# Altium schematic sheet 08 DDR VTT_LEDs.SchDoc
size 420 x 297 mm
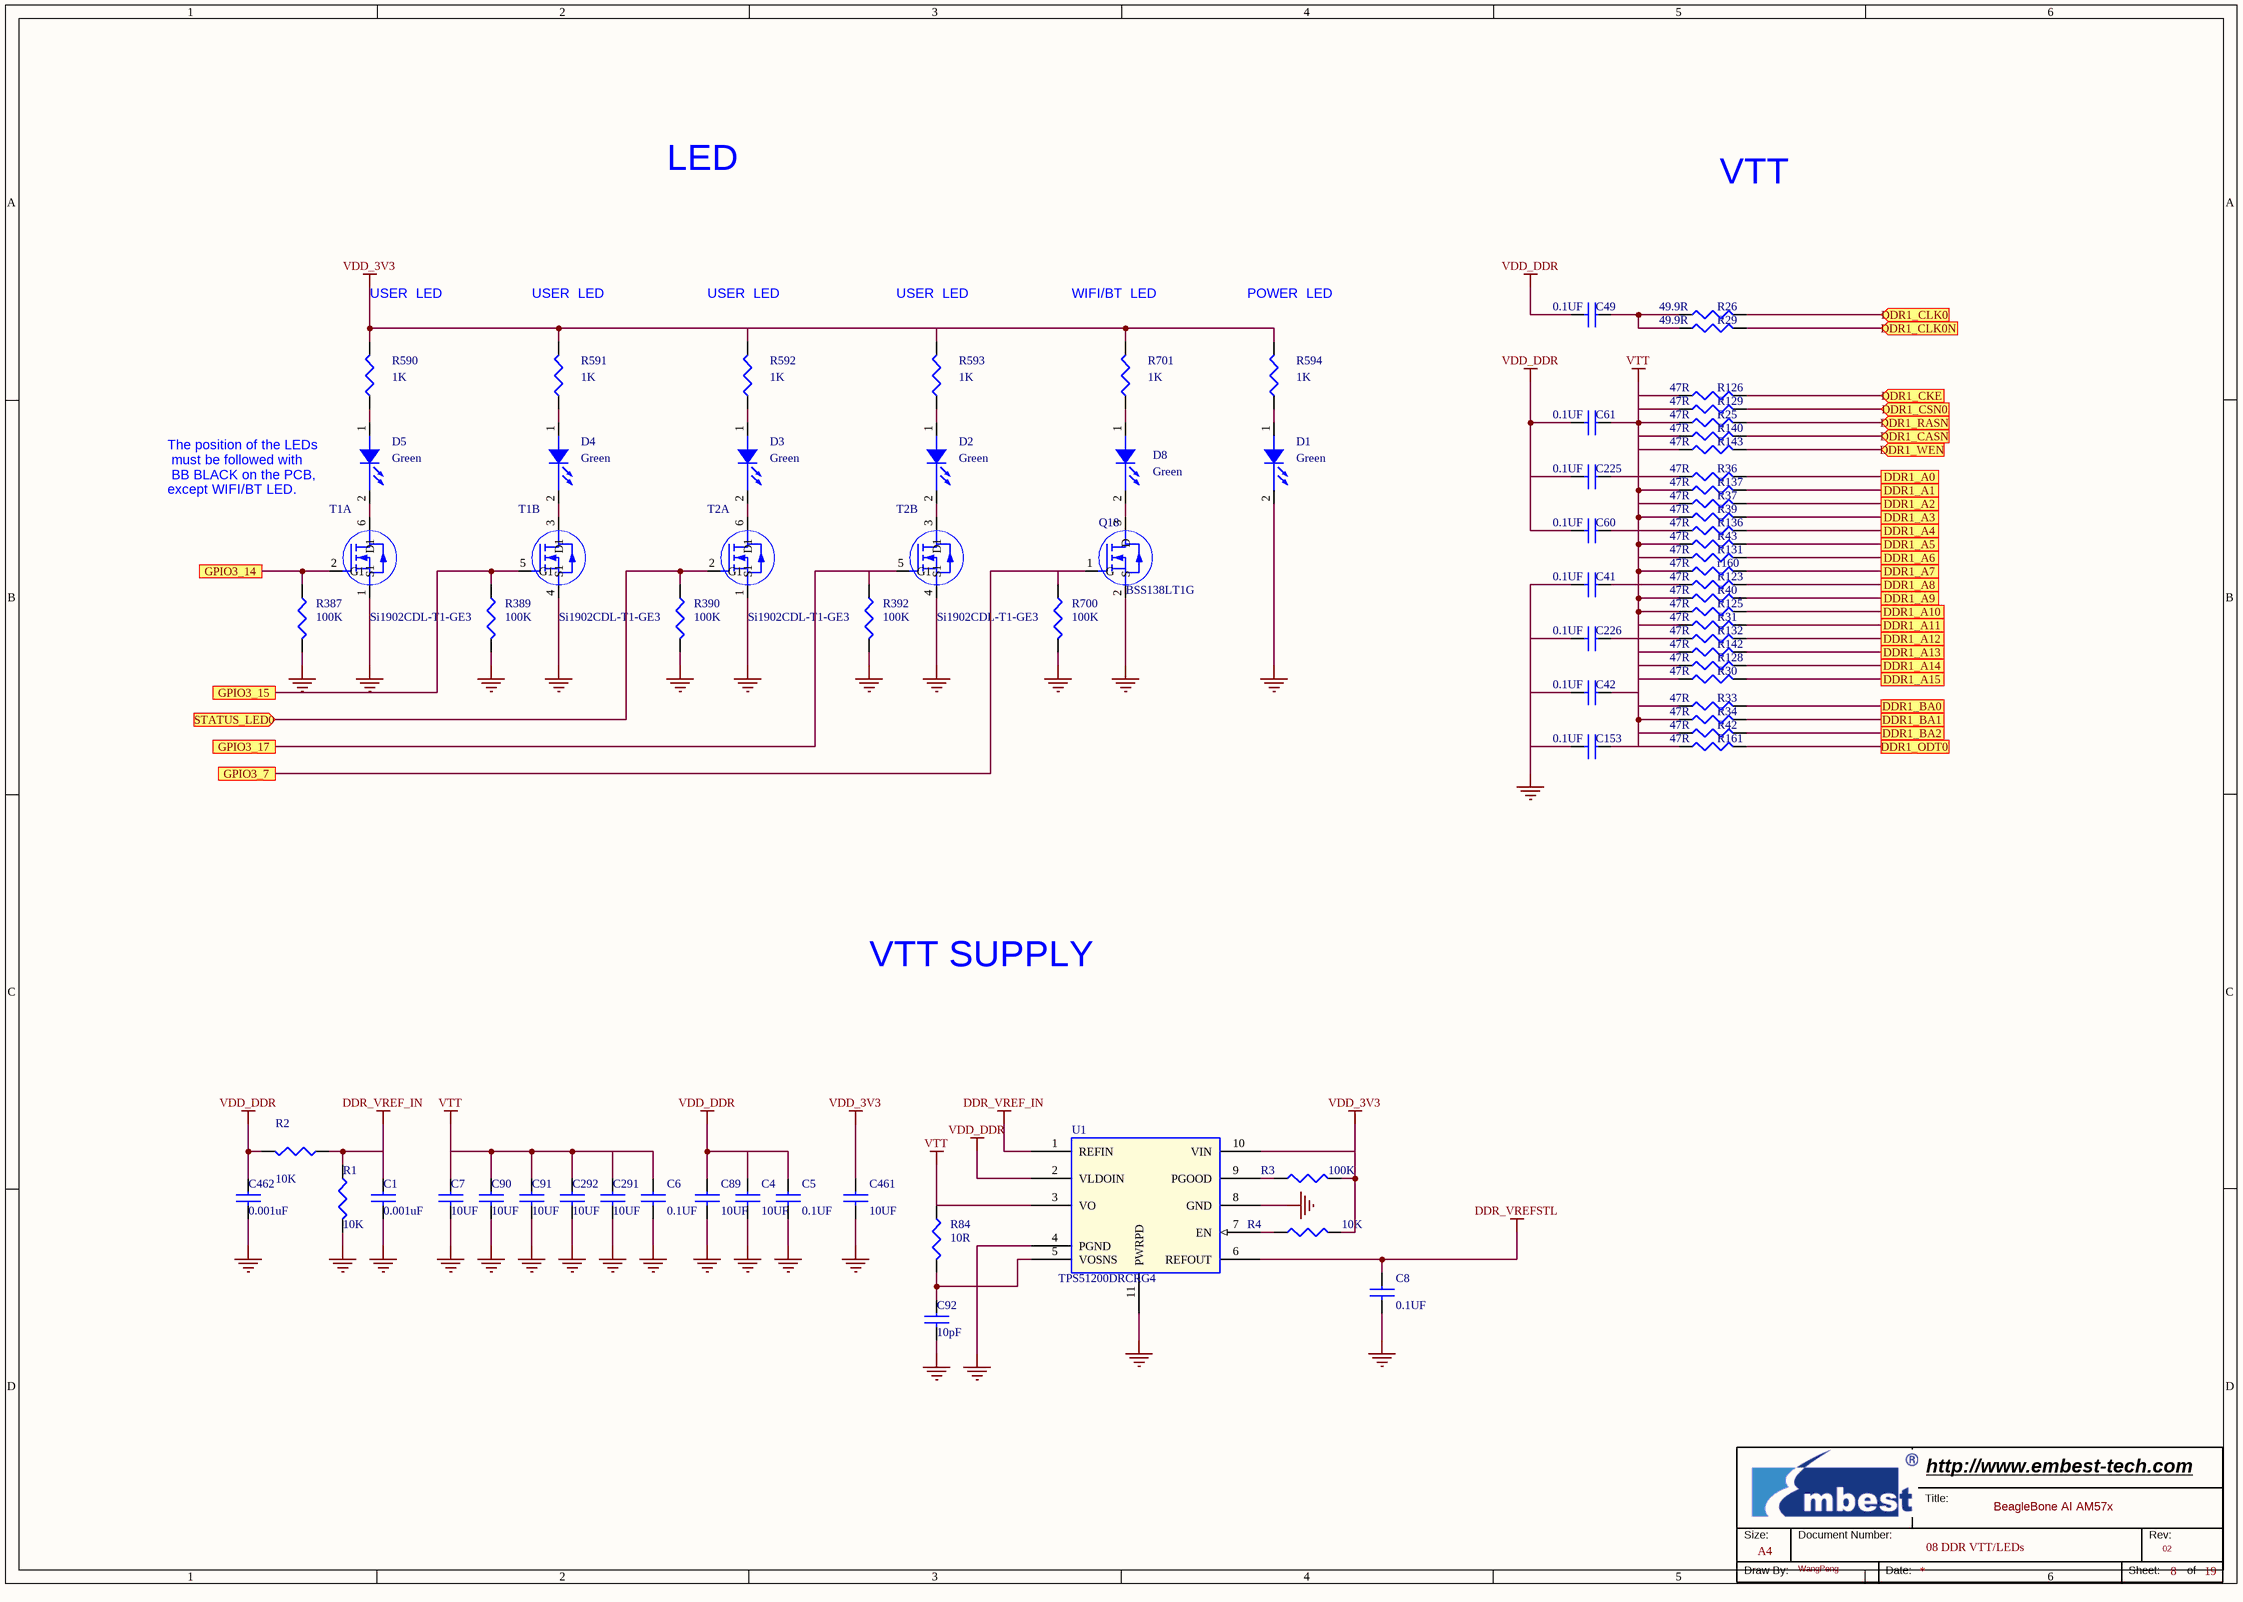
[diagram p0: 08 DDR VTT_LEDs.SchDoc]

## Parts
*  Page Count: 19  Page Number: 8  Page Size: A4  Title: BeagleBone AI AM57x  RevCode: 02  Doc: 08 DDR VTT/LEDs  Drawing: WangPeng  (hidden comment: Embest Title)  (graphical)
C1  0.001uF  [C0402]
C4  10UF  [C0603]
C5  0.1UF  [C0402]
C6  0.1UF  [C0402]
C7  10UF  [C0603]
C8  0.1UF  [C0402]
C41  0.1UF  [C0402]
C42  0.1UF  [C0402]
C49  0.1UF  [C0402]
C60  0.1UF  [C0402]
C61  0.1UF  [C0402]
C89  10UF  [C0603]
C90  10UF  [C0603]
C91  10UF  [C0603]
C92  10pF  [C0402]
C153  0.1UF  [C0402]
C225  0.1UF  [C0402]
C226  0.1UF  [C0402]
C291  10UF  [C0603]
C292  10UF  [C0603]
C461  10UF  [C0603]
C462  0.001uF  [C0402]
D1  Green  [D0603]
D2  Green  [D0603]
D3  Green  [D0603]
D4  Green  [D0603]
D5  Green  [D0603]
D8  Green  [D0603]
Q18  BSS138LT1G  [SOT95P240X111-3N]
R1  10K  [R0402]
R2  10K  [R0402]
R3  100K  [R0402]
R4  10K  [R0402]
R25  47R  [R0402]
R26  49.9R  [R0402]
R29  49.9R  [R0402]
R30  47R  [R0402]
R31  47R  [R0402]
R33  47R  [R0402]
R34  47R  [R0402]
R36  47R  [R0402]
R37  47R  [R0402]
R39  47R  [R0402]
R40  47R  [R0402]
R42  47R  [R0402]
R43  47R  [R0402]
R84  10R  [R0402]
R123  47R  [R0402]
R125  47R  [R0402]
R126  47R  [R0402]
R128  47R  [R0402]
R129  47R  [R0402]
R131  47R  [R0402]
R132  47R  [R0402]
R136  47R  [R0402]
R137  47R  [R0402]
R140  47R  [R0402]
R142  47R  [R0402]
R143  47R  [R0402]
r160  47R  [R0402]
R161  47R  [R0402]
R387  100K  [R0402]
R389  100K  [R0402]
R390  100K  [R0402]
R392  100K  [R0402]
R590  1K  [R0402]
R591  1K  [R0402]
R592  1K  [R0402]
R593  1K  [R0402]
R594  1K  [R0402]
R700  100K  [R0402]
R701  1K  [R0402]
T1  Si1902CDL-T1-GE3  [sot363_6]  (parts A,B of 2)
T2  Si1902CDL-T1-GE3  [sot363_6]  (parts A,B of 2)
U1  TPS51200DRCRG4  [VSON50P300X300X100-11N]

## Ports
DDR1_A0, DDR1_A1, DDR1_A2, DDR1_A3, DDR1_A4, DDR1_A5, DDR1_A6, DDR1_A7, DDR1_A8, DDR1_A9, DDR1_A10, DDR1_A11, DDR1_A12, DDR1_A13, DDR1_A14, DDR1_A15, DDR1_BA0, DDR1_BA1, DDR1_BA2, DDR1_CASN (in), DDR1_CKE (in), DDR1_CLK0 (in), DDR1_CLK0N (in), DDR1_CSN0 (in), DDR1_ODT0, DDR1_RASN (in), DDR1_WEN (in), GPIO3_7, GPIO3_14, GPIO3_15, GPIO3_17, STATUS_LED0 (in)

## Nets
DDR_VREF_IN: C1.1 R1.1 R2.1 U1.1(REFIN)
DDR_VREFSTL: C8.1 U1.6(REFOUT)
GND: C1.2 C4.2 C5.2 C6.2 C7.2 C8.2 C41.2 C42.2 C89.2 C90.2 C91.2 C92.2 C153.2 C226.2 C291.2 C292.2 C461.2 C462.2 D1.2(C) Q18.2(S) R1.2 R387.2 R389.2 R390.2 R392.2 R700.2 T1.1(S1) T1.4(S1) T2.1(S1) T2.4(S1) U1.4(PGND) U1.8(GND) U1.11(PWRPD)
VDD_3V3: C461.1 R3.2 R4.2 R590.2 R591.2 R592.2 R593.2 R594.2 R701.2 U1.10(VIN)
VDD_DDR: C4.1 C5.1 C49.2 C60.2 C61.2 C89.1 C225.2 C462.1 R2.2 U1.2(VLDOIN)
VTT: C6.1 C7.1 C42.1 C61.1 C90.1 C91.1 C153.1 C226.1 C291.1 C292.1 R25.2 R30.2 R31.2 R33.2 R34.2 R37.2 R39.2 R40.2 R42.2 R43.2 R84.1 R125.2 R126.2 R128.2 R129.2 R131.2 R132.2 R137.2 R140.2 R142.2 R143.2 r160.2 R161.2 U1.3(VO)
DDR1_A0: R36.1 ; port DDR1_A0
DDR1_A1: R137.1 ; port DDR1_A1
DDR1_A2: R37.1 ; port DDR1_A2
DDR1_A3: R39.1 ; port DDR1_A3
DDR1_A4: R136.1 ; port DDR1_A4
DDR1_A5: R43.1 ; port DDR1_A5
DDR1_A6: R131.1 ; port DDR1_A6
DDR1_A7: r160.1 ; port DDR1_A7
DDR1_A8: R123.1 ; port DDR1_A8
DDR1_A9: R40.1 ; port DDR1_A9
DDR1_A10: R125.1 ; port DDR1_A10
DDR1_A11: R31.1 ; port DDR1_A11
DDR1_A12: R132.1 ; port DDR1_A12
DDR1_A13: R142.1 ; port DDR1_A13
DDR1_A14: R128.1 ; port DDR1_A14
DDR1_A15: R30.1 ; port DDR1_A15
DDR1_BA0: R33.1 ; port DDR1_BA0
DDR1_BA1: R34.1 ; port DDR1_BA1
DDR1_BA2: R42.1 ; port DDR1_BA2
DDR1_CASN: R140.1 ; port DDR1_CASN
DDR1_CKE: R126.1 ; port DDR1_CKE
DDR1_CLK0: R26.1 ; port DDR1_CLK0
DDR1_CLK0N: R29.1 ; port DDR1_CLK0N
DDR1_CSN0: R129.1 ; port DDR1_CSN0
DDR1_ODT0: R161.1 ; port DDR1_ODT0
DDR1_RASN: R25.1 ; port DDR1_RASN
DDR1_WEN: R143.1 ; port DDR1_WEN
GPIO3_7: Q18.1(G) R700.1 ; port GPIO3_7
GPIO3_14: R387.1 T1.2(G1) ; port GPIO3_14
GPIO3_15: R389.1 T1.5(G1) ; port GPIO3_15
GPIO3_17: R392.1 T2.5(G1) ; port GPIO3_17
STATUS_LED0: R390.1 T2.2(G1) ; port STATUS_LED0
NetC41_1: C41.1 R123.2
NetC49_1: C49.1 R26.2 R29.2
NetC60_1: C60.1 R136.2
NetC92_1: C92.1 R84.2 U1.5(VOSNS)
NetC225_1: C225.1 R36.2
NetD1_1: D1.1(A) R594.1
NetD2_1: D2.1(A) R593.1
NetD2_2: D2.2(C) T2.3(D1)
NetD3_1: D3.1(A) R592.1
NetD3_2: D3.2(C) T2.6(D1)
NetD4_1: D4.1(A) R591.1
NetD4_2: D4.2(C) T1.3(D1)
NetD5_1: D5.1(A) R590.1
NetD5_2: D5.2(C) T1.6(D1)
NetD8_1: D8.1(A) R701.1
NetD8_2: D8.2(C) Q18.3(D)
NetR3_1: R3.1 U1.9(PGOOD)
NetR4_1: R4.1 U1.7(EN)

## Notes on the sheet
- LED
- VTT
- (near R590) USER  LED
- (near R591) USER  LED
- (near R592) USER  LED
- (near R593) USER  LED
- (near R701) WIFI/BT  LED
- (near R594) POWER  LED
- The position of the LEDs
  must be followed with
  BB BLACK on the PCB,
  except WIFI/BT LED.
- VTT SUPPLY
- (in symbol Embest Title) Title:; Size:; Document Number:; Rev:; Draw By:; Date:; Sheet:; of

## Library data of the parts
C1 = C: CAP,1NF,+/-10%,X7R,50V,SMD0402; Manufacturer Part Number: GRM155R71H102KA01D; Manufacturer: Murata; Embest PN: 1004001100030; Part Type: Ceramic Capacitor
C4 C7 C89-C91 C291 C461 = C: CAP,10UF,+/-10%,X5R,10V,SMD0603; Manufacturer: Murata; Manufacturer Part Number: GRM188R61A106KE69D; Embest PN: 1004001100129; Part Type: Ceramic Capacitor; Datasheet: Y:\ÐÂK3ÏµÍ³ÎïÁÏdatasheet\[1003_1004]capacitor-resistor µçÈÝ¡¢µç×è\1004001100129T2 C1608X5R1A106M.pdf
C5 C41 C60 C61 C225 C226 = C: CAP,100NF,+/-10%,X7R,16V,SMD0402; Manufacturer: Murata; Manufacturer Part Number: GRM155R71C104KA88D; Embest PN: 1004001100047; Part Type: Ceramic Capacitor; Datasheet: Y:\ÐÂK3ÏµÍ³ÎïÁÏdatasheet\[1003_1004]capacitor-resistor µçÈÝ¡¢µç×è\1004001100047-GRM155R71C104KA88D.pdf
C6 C8 C42 C49 C153 = C: CAP,100NF,+/-10%,X7R,16V,SMD0402; Manufacturer Part Number: GRM155R71C104KA88D; Manufacturer: Murata; Embest PN: 1004001100047; Datasheet: Y:\ÐÂK3ÏµÍ³ÎïÁÏdatasheet\[1003_1004]capacitor-resistor µçÈÝ¡¢µç×è\1004001100047-GRM155R71C104KA88D.pdf; Part Type: Ceramic Capacitor
C92 = C: CAP,10PF,+/-5%,C0G,50V,SMD0402; Manufacturer: MURATA; Manufacturer Part Number: GRM1555C1H100JA01D; Embest PN: 1004001100005; Part Type: Ceramic Capacitor
C292 = C: CAP,10UF,+/-10%,X5R,10V,SMD0603; Manufacturer Part Number: GRM188R61A106KE69D; Manufacturer: Murata; Embest PN: 1004001100129; Datasheet: Y:\ÐÂK3ÏµÍ³ÎïÁÏdatasheet\[1003_1004]capacitor-resistor µçÈÝ¡¢µç×è\1004001100129T2 C1608X5R1A106M.pdf; Part Type: Ceramic Capacitor
C462 = C: CAP,1NF,+/-10%,X7R,50V,SMD0402; Manufacturer: Murata; Manufacturer Part Number: GRM155R71H102KA01D; Embest PN: 1004001100030; Part Type: Ceramic Capacitor
D1-D5 = LED: LED,Super Yellow Green,Water Clear,20mA,SMD0603; Manufacturer: Everlight; Manufacturer Part Number: 19-217/G7C-AN1P2/3T; Embest PN: 1006001100015; Part Type: LED; Status: AVL
D8 = LED: LED,Super Yellow Green,Water Clear,20mA,SMD0603; Manufacturer Part Number: 19-217/G7C-AN1P2/3T; Manufacturer: Everlight; Embest PN: 1006001100015; Status: AVL; Part Type: LED
Q18 = NMOS: Mosfet,N-Channel,BSS138LT1G,50V,0.2A,SOT-23,SMD; Manufacturer: ON; Embest PN: 1006015100009; Part Type: MOSFET; Manufacturer Part Number: BSS138LT1G; Status: AM5728; Datasheet: Y:\ÐÂK3ÏµÍ³ÎïÁÏdatasheet\[1006014~16]mosfet ³¡Ð§Ó¦¹Ü\1006015100009_bss138lt1g_ON.pdf
R1 = R: RES,10K,+/-1%,1/16W,SMD0402; Manufacturer Part Number: RC0402FR-0710KL; Manufacturer: YAGEO; Embest PN: 1003001100071; Part Type: Thick film Resistor
R2 = R: RES,10K,+/-1%,1/16W,SMD0402; Manufacturer: YAGEO; Manufacturer Part Number: RC0402FR-0710KL; Embest PN: 1003001100071; Part Type: Thick film Resistor
R3 R387 R389 R390 R392 R700 = R: RES,100K,+/-5%,1/16W,SMD0402; Manufacturer: YAGEO; Manufacturer Part Number: RC0402JR-07100KL; Embest PN: 1003001100119; Part Type: Thick film Resistor
R4 = R: RES,10K,+/-5%,1/16W,SMD0402; Manufacturer: YAGEO; Manufacturer Part Number: RC0402JR-0710KL; Embest PN: 1003001100072; Part Type: Thick film Resistor
R25 R30 R33 R34 R36 R37 R40 R42 R43 R125 R126 R128 R132 R136 R143 r160 R161 = R: RES,47R,+/-1%,1/16W,SMD0402; Manufacturer: YAGEO; Manufacturer Part Number: RC0402FR-0747RL; Embest PN: 1003001100518; Part Type: Thick film Resistor
R26 = R: RES,49R9,+/-1%,1/16W,SMD0402; Manufacturer Part Number: RC0402FR-0749R9L; Manufacturer: YAGEO; Embest PN: 1003001100015; Part Type: Thick film Resistor
R29 = R: RES,49R9,+/-1%,1/16W,SMD0402; Manufacturer: YAGEO; Manufacturer Part Number: RC0402FR-0749R9L; Embest PN: 1003001100015; Part Type: Thick film Resistor
R31 R39 R123 R129 R131 R137 R140 R142 = R: RES,47R,+/-1%,1/16W,SMD0402; Manufacturer Part Number: RC0402FR-0747RL; Manufacturer: YAGEO; Embest PN: 1003001100518; Part Type: Thick film Resistor
R84 = R: RES,10R,+/-1%,1/16W,SMD0402; Manufacturer Part Number: RC0402FR-0710RL; Manufacturer: YAGEO; Embest PN: 1003001100004; Part Type: Thick film Resistor
R590 R592 R594 = R: RES,1K,+/-5%,1/16W,SMD0402; Manufacturer: YAGEO; Manufacturer Part Number: RC0402JR-071KL; Embest PN: 1003001100035; Part Type: Thick film Resistor
R591 R593 R701 = R: RES,1K,+/-5%,1/16W,SMD0402; Manufacturer Part Number: RC0402JR-071KL; Manufacturer: YAGEO; Embest PN: 1003001100035; Part Type: Thick film Resistor
T1 T2 = NMOS_2S2G2D: Mosfet,N-Channel,Si1902CDL-T1-GE3,20V,385mohm,1.5A,SOT-363,SMD; Manufacturer: VISHAY; Embest PN: 1006015100011; Part Type: MOSFET; Manufacturer Part Number: Si1902CDL-T1-GE3; Status: TBD; Datasheet: Y:\ÐÂK3ÏµÍ³ÎïÁÏdatasheet\[1006014~16]mosfet ³¡Ð§Ó¦¹Ü\1006015100011_si1902cdl_Vishay.pdf
U1 = TPS51200: IC Sink and Source DDR Termination Regulator VSON-10 SMD; Manufacturer: TI; Embest PN: 1002020100280; Part Type: Specific IC; Manufacturer Part Number: TPS51200DRCRG4; Status: AM5728; Datasheet: Y:\ÐÂK3ÏµÍ³ÎïÁÏdatasheet\[1002]IC ¼¯³ÉµçÂ·\1002020100280 [TPS51200DRCRG4]TPS51200.pdf
* = Embest Title: Page Create Date: May 29, 2006; WebSite: http://www.embest-tech.com; Company: Embest; Page Modify Date: *